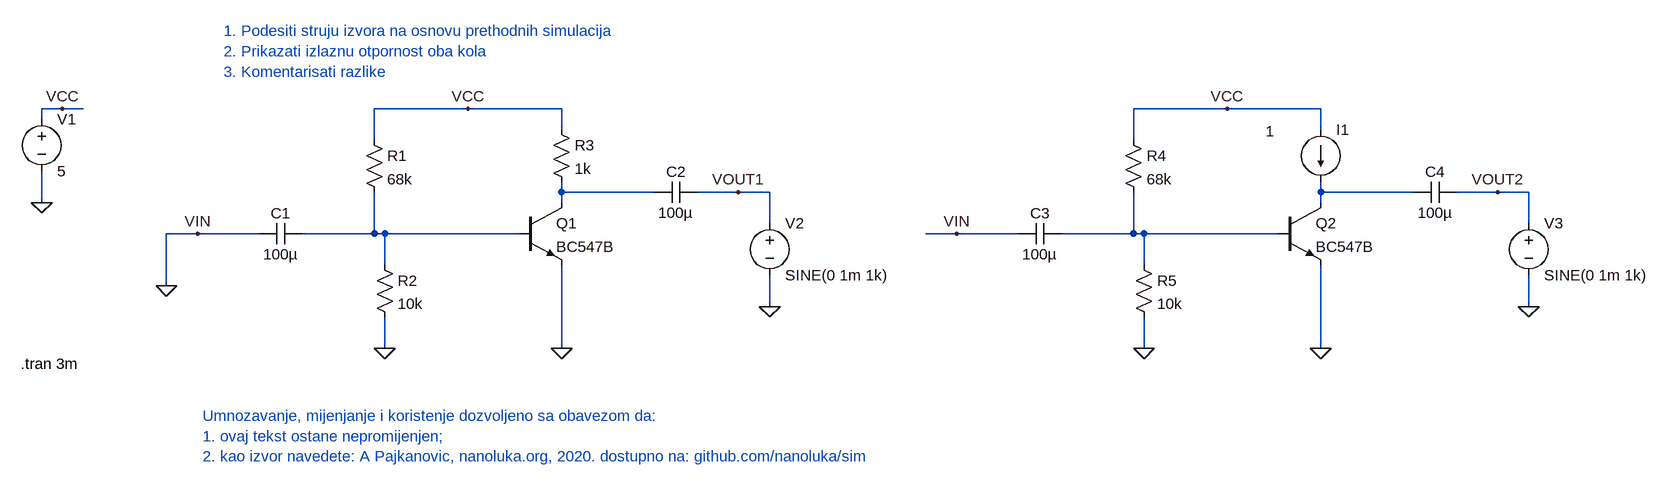
[diagram p0: schematic 04_izlaznaOtpornost_ZE.asc]
04_izlaznaOtpornost_ZE.asc, the LTspice schematic file:
Version 4
SHEET 1 1816 680
WIRE -624 -48 -656 -48
WIRE -592 -48 -624 -48
WIRE 0 -48 -144 -48
WIRE 144 -48 0 -48
WIRE 1168 -48 1024 -48
WIRE 1312 -48 1168 -48
WIRE -656 -32 -656 -48
WIRE 144 -16 144 -48
WIRE 1312 -16 1312 -48
WIRE -144 0 -144 -48
WIRE 1024 0 1024 -48
WIRE 144 80 144 64
WIRE 288 80 144 80
WIRE 416 80 352 80
WIRE 464 80 416 80
WIRE 1312 80 1312 64
WIRE 1456 80 1312 80
WIRE 1584 80 1520 80
WIRE 1632 80 1584 80
WIRE -656 96 -656 48
WIRE 144 96 144 80
WIRE 1312 96 1312 80
WIRE 464 128 464 80
WIRE 1632 128 1632 80
WIRE -416 144 -464 144
WIRE -320 144 -416 144
WIRE -144 144 -144 80
WIRE -144 144 -256 144
WIRE -128 144 -144 144
WIRE 80 144 -128 144
WIRE 752 144 704 144
WIRE 848 144 752 144
WIRE 1024 144 1024 80
WIRE 1024 144 912 144
WIRE 1040 144 1024 144
WIRE 1248 144 1040 144
WIRE -128 192 -128 144
WIRE 1040 192 1040 144
WIRE -464 224 -464 144
WIRE 464 256 464 208
WIRE 1632 256 1632 208
WIRE -128 320 -128 272
WIRE 144 320 144 192
WIRE 1040 320 1040 272
WIRE 1312 320 1312 192
FLAG -656 96 0
FLAG -128 320 0
FLAG 144 320 0
FLAG -624 -48 VCC
FLAG 0 -48 VCC
FLAG -416 144 VIN
FLAG 1040 320 0
FLAG 1312 320 0
FLAG 1168 -48 VCC
FLAG 752 144 VIN
FLAG 416 80 VOUT1
FLAG 1584 80 VOUT2
FLAG -464 224 0
FLAG 464 256 0
FLAG 1632 256 0
SYMBOL res -160 -16 R0
SYMATTR InstName R1
SYMATTR Value 68k
SYMBOL res -144 176 R0
SYMATTR InstName R2
SYMATTR Value 10k
SYMBOL npn 80 96 R0
SYMATTR InstName Q1
SYMATTR Value BC547B
SYMBOL cap -256 128 R90
WINDOW 0 0 32 VBottom 2
WINDOW 3 32 32 VTop 2
SYMATTR InstName C1
SYMATTR Value 100µ
SYMBOL voltage -656 -48 R0
WINDOW 123 0 0 Left 2
WINDOW 39 0 0 Left 2
SYMATTR InstName V1
SYMATTR Value 5
SYMBOL cap 352 64 R90
WINDOW 0 0 32 VBottom 2
WINDOW 3 32 32 VTop 2
SYMATTR InstName C2
SYMATTR Value 100µ
SYMBOL res 128 -32 R0
SYMATTR InstName R3
SYMATTR Value 1k
SYMBOL res 1008 -16 R0
SYMATTR InstName R4
SYMATTR Value 68k
SYMBOL res 1024 176 R0
SYMATTR InstName R5
SYMATTR Value 10k
SYMBOL npn 1248 96 R0
SYMATTR InstName Q2
SYMATTR Value BC547B
SYMBOL cap 912 128 R90
WINDOW 0 0 32 VBottom 2
WINDOW 3 32 32 VTop 2
SYMATTR InstName C3
SYMATTR Value 100µ
SYMBOL cap 1520 64 R90
WINDOW 0 0 32 VBottom 2
WINDOW 3 32 32 VTop 2
SYMATTR InstName C4
SYMATTR Value 100µ
SYMBOL current 1312 -16 R0
WINDOW 3 -85 2 Left 2
WINDOW 123 0 0 Left 2
WINDOW 39 0 0 Left 2
SYMATTR Value 1
SYMATTR InstName I1
SYMBOL voltage 464 112 R0
WINDOW 123 0 0 Left 2
WINDOW 39 0 0 Left 2
SYMATTR InstName V2
SYMATTR Value SINE(0 1m 1k)
SYMBOL voltage 1632 112 R0
WINDOW 123 0 0 Left 2
WINDOW 39 0 0 Left 2
SYMATTR InstName V3
SYMATTR Value SINE(0 1m 1k)
TEXT -688 344 Left 2 !.tran 3m
TEXT -376 -168 Left 2 ;1. Podesiti struju izvora na osnovu prethodnih simulacija\n2. Prikazati izlaznu otpornost oba kola\n3. Komentarisati razlike
TEXT -408 424 Left 2 ;Umnozavanje, mijenjanje i koristenje dozvoljeno sa obavezom da:\n1. ovaj tekst ostane nepromijenjen;\n2. kao izvor navedete: A Pajkanovic, nanoluka.org, 2020. dostupno na: github.com/nanoluka/sim

The netlist it stands for:
* 04_izlaznaOtpornost_ZE.asc
R1 VCC N003 68k
R2 N003 0 10k
Q1 N001 N003 0 0 BC547B
C1 N003 0 100µ
V1 VCC 0 5
C2 VOUT1 N001 100µ
R3 VCC N001 1k
R4 VCC N004 68k
R5 N004 0 10k
Q2 N002 N004 0 0 BC547B
C3 N004 0 100µ
C4 VOUT2 N002 100µ
I1 VCC N002 1
V2 VOUT1 0 SINE(0 1m 1k)
V3 VOUT2 0 SINE(0 1m 1k)
.model NPN NPN
.model PNP PNP
.lib standard.bjt
.tran 3m
* 1. Podesiti struju izvora na osnovu prethodnih simulacija
* 2. Prikazati izlaznu otpornost oba kola
* 3. Komentarisati razlike
* Umnozavanje, mijenjanje i koristenje dozvoljeno sa obavezom da:
* 1. ovaj tekst ostane nepromijenjen;
* 2. kao izvor navedete: A Pajkanovic, nanoluka.org, 2020. dostupno na: github.com/nanoluka/sim
.backanno
.end